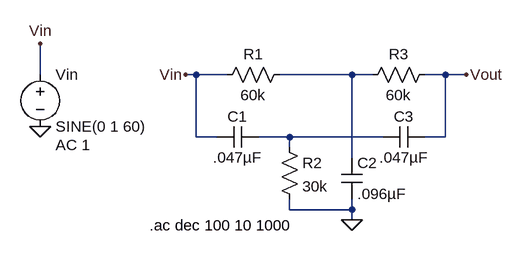
[diagram p0: schematic TwinTNotch.asc]
TwinTNotch.asc, the LTspice schematic file:
Version 4
SHEET 1 880 680
WIRE -224 144 -224 96
WIRE 16 144 0 144
WIRE 64 144 16 144
WIRE 256 144 144 144
WIRE 288 144 256 144
WIRE 400 144 368 144
WIRE 432 144 400 144
WIRE 16 240 16 144
WIRE 48 240 16 240
WIRE 160 240 112 240
WIRE 304 240 160 240
WIRE 400 240 400 144
WIRE 400 240 368 240
WIRE 160 256 160 240
WIRE 256 272 256 144
WIRE 160 352 160 336
WIRE 256 352 256 336
WIRE 256 352 160 352
WIRE 256 368 256 352
FLAG 0 144 Vin
FLAG 432 144 Vout
FLAG 256 368 0
FLAG -224 224 0
FLAG -224 96 Vin
SYMBOL cap 112 224 R90
WINDOW 0 0 32 VBottom 2
WINDOW 3 32 32 VTop 2
SYMATTR InstName C1
SYMATTR Value .047µF
SYMBOL res 144 240 R0
SYMATTR InstName R2
SYMATTR Value 30k
SYMBOL cap 240 272 R0
SYMATTR InstName C2
SYMATTR Value .096µF
SYMBOL res 160 128 R90
WINDOW 0 0 56 VBottom 2
WINDOW 3 32 56 VTop 2
SYMATTR InstName R1
SYMATTR Value 60k
SYMBOL res 384 128 R90
WINDOW 0 0 56 VBottom 2
WINDOW 3 32 56 VTop 2
SYMATTR InstName R3
SYMATTR Value 60k
SYMBOL cap 368 224 R90
WINDOW 0 0 32 VBottom 2
WINDOW 3 32 32 VTop 2
SYMATTR InstName C3
SYMATTR Value .047µF
SYMBOL voltage -224 128 R0
WINDOW 123 24 124 Left 2
WINDOW 39 0 0 Left 2
SYMATTR Value2 AC 1
SYMATTR InstName Vin
SYMATTR Value SINE(0 1 60)
TEXT -56 376 Left 2 !.ac dec 100 10 1000

The netlist it stands for:
* TwinTNotch.asc
C1 N002 Vin .047µF
R2 N002 0 30k
C2 N001 0 .096µF
R1 N001 Vin 60k
R3 Vout N001 60k
C3 Vout N002 .047µF
Vin Vin 0 SINE(0 1 60) AC 1
.ac dec 100 10 1000
.backanno
.end